# EAGLE design charlie_array_0805_v1 (EAGLE 6.4)
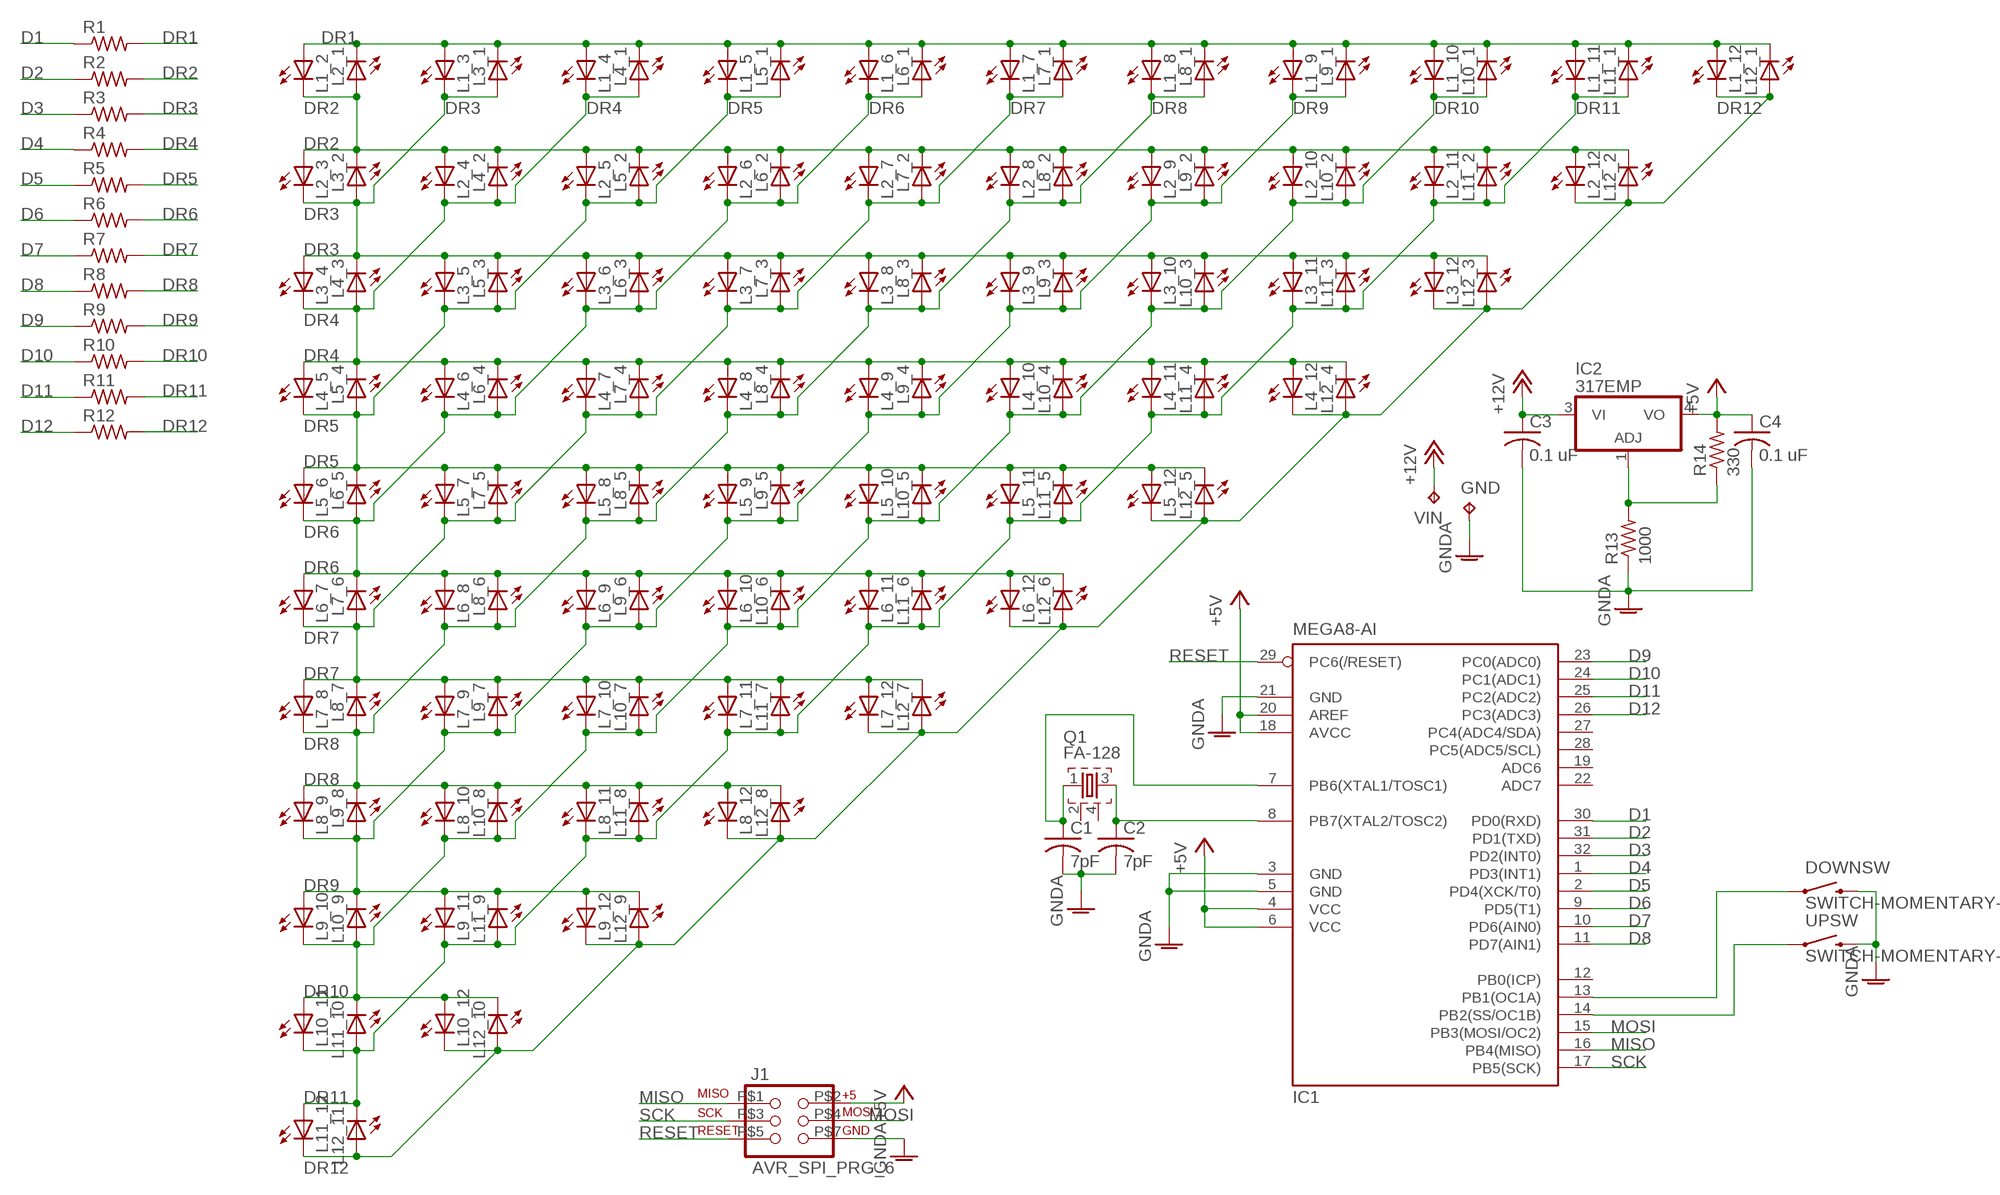
[diagram p0: schematic, sheet 1]

## Parts
C1  7pF  C-USC0603  [C0603]
C2  7pF  C-USC0603  [C0603]
C3  0.1 uF  C-USC0603  [C0603]
C4  0.1 uF  C-USC0603  [C0603]
DOWNSW  SWITCH-MOMENTARY-2  [TACTILE_SWITCH_TALL]
GND  TPTP20SQ  [TP20SQ]
IC1  MEGA8-AI  [TQFP32-08]
IC2  317EMP  [SOT223]
J1  AVR_SPI_PRG_6  [2X3_ICSP_SMD]
L1_2  LEDCHIPLED_0805  [CHIPLED_0805]
L1_3  LEDCHIPLED_0805  [CHIPLED_0805]
L1_4  LEDCHIPLED_0805  [CHIPLED_0805]
L1_5  LEDCHIPLED_0805  [CHIPLED_0805]
L1_6  LEDCHIPLED_0805  [CHIPLED_0805]
L1_7  LEDCHIPLED_0805  [CHIPLED_0805]
L1_8  LEDCHIPLED_0805  [CHIPLED_0805]
L1_9  LEDCHIPLED_0805  [CHIPLED_0805]
L1_10  LEDCHIPLED_0805  [CHIPLED_0805]
L1_11  LEDCHIPLED_0805  [CHIPLED_0805]
L1_12  LEDCHIPLED_0805  [CHIPLED_0805]
L2_1  LEDCHIPLED_0805  [CHIPLED_0805]
L2_3  LEDCHIPLED_0805  [CHIPLED_0805]
L2_4  LEDCHIPLED_0805  [CHIPLED_0805]
L2_5  LEDCHIPLED_0805  [CHIPLED_0805]
L2_6  LEDCHIPLED_0805  [CHIPLED_0805]
L2_7  LEDCHIPLED_0805  [CHIPLED_0805]
L2_8  LEDCHIPLED_0805  [CHIPLED_0805]
L2_9  LEDCHIPLED_0805  [CHIPLED_0805]
L2_10  LEDCHIPLED_0805  [CHIPLED_0805]
L2_11  LEDCHIPLED_0805  [CHIPLED_0805]
L2_12  LEDCHIPLED_0805  [CHIPLED_0805]
L3_1  LEDCHIPLED_0805  [CHIPLED_0805]
L3_2  LEDCHIPLED_0805  [CHIPLED_0805]
L3_4  LEDCHIPLED_0805  [CHIPLED_0805]
L3_5  LEDCHIPLED_0805  [CHIPLED_0805]
L3_6  LEDCHIPLED_0805  [CHIPLED_0805]
L3_7  LEDCHIPLED_0805  [CHIPLED_0805]
L3_8  LEDCHIPLED_0805  [CHIPLED_0805]
L3_9  LEDCHIPLED_0805  [CHIPLED_0805]
L3_10  LEDCHIPLED_0805  [CHIPLED_0805]
L3_11  LEDCHIPLED_0805  [CHIPLED_0805]
L3_12  LEDCHIPLED_0805  [CHIPLED_0805]
L4_1  LEDCHIPLED_0805  [CHIPLED_0805]
L4_2  LEDCHIPLED_0805  [CHIPLED_0805]
L4_3  LEDCHIPLED_0805  [CHIPLED_0805]
L4_5  LEDCHIPLED_0805  [CHIPLED_0805]
L4_6  LEDCHIPLED_0805  [CHIPLED_0805]
L4_7  LEDCHIPLED_0805  [CHIPLED_0805]
L4_8  LEDCHIPLED_0805  [CHIPLED_0805]
L4_9  LEDCHIPLED_0805  [CHIPLED_0805]
L4_10  LEDCHIPLED_0805  [CHIPLED_0805]
L4_11  LEDCHIPLED_0805  [CHIPLED_0805]
L4_12  LEDCHIPLED_0805  [CHIPLED_0805]
L5_1  LEDCHIPLED_0805  [CHIPLED_0805]
L5_2  LEDCHIPLED_0805  [CHIPLED_0805]
L5_3  LEDCHIPLED_0805  [CHIPLED_0805]
L5_4  LEDCHIPLED_0805  [CHIPLED_0805]
L5_6  LEDCHIPLED_0805  [CHIPLED_0805]
L5_7  LEDCHIPLED_0805  [CHIPLED_0805]
L5_8  LEDCHIPLED_0805  [CHIPLED_0805]
L5_9  LEDCHIPLED_0805  [CHIPLED_0805]
L5_10  LEDCHIPLED_0805  [CHIPLED_0805]
L5_11  LEDCHIPLED_0805  [CHIPLED_0805]
L5_12  LEDCHIPLED_0805  [CHIPLED_0805]
L6_1  LEDCHIPLED_0805  [CHIPLED_0805]
L6_2  LEDCHIPLED_0805  [CHIPLED_0805]
L6_3  LEDCHIPLED_0805  [CHIPLED_0805]
L6_4  LEDCHIPLED_0805  [CHIPLED_0805]
L6_5  LEDCHIPLED_0805  [CHIPLED_0805]
L6_7  LEDCHIPLED_0805  [CHIPLED_0805]
L6_8  LEDCHIPLED_0805  [CHIPLED_0805]
L6_9  LEDCHIPLED_0805  [CHIPLED_0805]
L6_10  LEDCHIPLED_0805  [CHIPLED_0805]
L6_11  LEDCHIPLED_0805  [CHIPLED_0805]
L6_12  LEDCHIPLED_0805  [CHIPLED_0805]
L7_1  LEDCHIPLED_0805  [CHIPLED_0805]
L7_2  LEDCHIPLED_0805  [CHIPLED_0805]
L7_3  LEDCHIPLED_0805  [CHIPLED_0805]
L7_4  LEDCHIPLED_0805  [CHIPLED_0805]
L7_5  LEDCHIPLED_0805  [CHIPLED_0805]
L7_6  LEDCHIPLED_0805  [CHIPLED_0805]
L7_8  LEDCHIPLED_0805  [CHIPLED_0805]
L7_9  LEDCHIPLED_0805  [CHIPLED_0805]
L7_10  LEDCHIPLED_0805  [CHIPLED_0805]
L7_11  LEDCHIPLED_0805  [CHIPLED_0805]
L7_12  LEDCHIPLED_0805  [CHIPLED_0805]
L8_1  LEDCHIPLED_0805  [CHIPLED_0805]
L8_2  LEDCHIPLED_0805  [CHIPLED_0805]
L8_3  LEDCHIPLED_0805  [CHIPLED_0805]
L8_4  LEDCHIPLED_0805  [CHIPLED_0805]
L8_5  LEDCHIPLED_0805  [CHIPLED_0805]
L8_6  LEDCHIPLED_0805  [CHIPLED_0805]
L8_7  LEDCHIPLED_0805  [CHIPLED_0805]
L8_9  LEDCHIPLED_0805  [CHIPLED_0805]
L8_10  LEDCHIPLED_0805  [CHIPLED_0805]
L8_11  LEDCHIPLED_0805  [CHIPLED_0805]
L8_12  LEDCHIPLED_0805  [CHIPLED_0805]
L9_1  LEDCHIPLED_0805  [CHIPLED_0805]
L9_2  LEDCHIPLED_0805  [CHIPLED_0805]
L9_3  LEDCHIPLED_0805  [CHIPLED_0805]
L9_4  LEDCHIPLED_0805  [CHIPLED_0805]
L9_5  LEDCHIPLED_0805  [CHIPLED_0805]
L9_6  LEDCHIPLED_0805  [CHIPLED_0805]
L9_7  LEDCHIPLED_0805  [CHIPLED_0805]
L9_8  LEDCHIPLED_0805  [CHIPLED_0805]
L9_10  LEDCHIPLED_0805  [CHIPLED_0805]
L9_11  LEDCHIPLED_0805  [CHIPLED_0805]
L9_12  LEDCHIPLED_0805  [CHIPLED_0805]
L10_1  LEDCHIPLED_0805  [CHIPLED_0805]
L10_2  LEDCHIPLED_0805  [CHIPLED_0805]
L10_3  LEDCHIPLED_0805  [CHIPLED_0805]
L10_4  LEDCHIPLED_0805  [CHIPLED_0805]
L10_5  LEDCHIPLED_0805  [CHIPLED_0805]
L10_6  LEDCHIPLED_0805  [CHIPLED_0805]
L10_7  LEDCHIPLED_0805  [CHIPLED_0805]
L10_8  LEDCHIPLED_0805  [CHIPLED_0805]
L10_9  LEDCHIPLED_0805  [CHIPLED_0805]
L10_11  LEDCHIPLED_0805  [CHIPLED_0805]
L10_12  LEDCHIPLED_0805  [CHIPLED_0805]
L11_1  LEDCHIPLED_0805  [CHIPLED_0805]
L11_2  LEDCHIPLED_0805  [CHIPLED_0805]
L11_3  LEDCHIPLED_0805  [CHIPLED_0805]
L11_4  LEDCHIPLED_0805  [CHIPLED_0805]
L11_5  LEDCHIPLED_0805  [CHIPLED_0805]
L11_6  LEDCHIPLED_0805  [CHIPLED_0805]
L11_7  LEDCHIPLED_0805  [CHIPLED_0805]
L11_8  LEDCHIPLED_0805  [CHIPLED_0805]
L11_9  LEDCHIPLED_0805  [CHIPLED_0805]
L11_10  LEDCHIPLED_0805  [CHIPLED_0805]
L11_12  LEDCHIPLED_0805  [CHIPLED_0805]
L12_1  LEDCHIPLED_0805  [CHIPLED_0805]
L12_2  LEDCHIPLED_0805  [CHIPLED_0805]
L12_3  LEDCHIPLED_0805  [CHIPLED_0805]
L12_4  LEDCHIPLED_0805  [CHIPLED_0805]
L12_5  LEDCHIPLED_0805  [CHIPLED_0805]
L12_6  LEDCHIPLED_0805  [CHIPLED_0805]
L12_7  LEDCHIPLED_0805  [CHIPLED_0805]
L12_8  LEDCHIPLED_0805  [CHIPLED_0805]
L12_9  LEDCHIPLED_0805  [CHIPLED_0805]
L12_10  LEDCHIPLED_0805  [CHIPLED_0805]
L12_11  LEDCHIPLED_0805  [CHIPLED_0805]
Q1  FA-128  [FA-128]
R1  R-US_R0603  [R0603]
R2  R-US_R0603  [R0603]
R3  R-US_R0603  [R0603]
R4  R-US_R0603  [R0603]
R5  R-US_R0603  [R0603]
R6  R-US_R0603  [R0603]
R7  R-US_R0603  [R0603]
R8  R-US_R0603  [R0603]
R9  R-US_R0603  [R0603]
R10  R-US_R0603  [R0603]
R11  R-US_R0603  [R0603]
R12  R-US_R0603  [R0603]
R13  1000  R-US_R0603  [R0603]
R14  330  R-US_R0603  [R0603]
UPSW  SWITCH-MOMENTARY-2  [TACTILE_SWITCH_TALL]
VIN  TPTP20SQ  [TP20SQ]

## Nets
+5V: C4.1 IC1.4(VCC) IC1.6(VCC) IC1.18(AVCC) IC1.20(AREF) IC2.4(VO) J1.P$2 R14.2
+12V: C3.1 IC2.3(VI) VIN.TP
D1: IC1.30(PD0(RXD)) R1.1
D2: IC1.31(PD1(TXD)) R2.1
D3: IC1.32(PD2(INT0)) R3.1
D4: IC1.1(PD3(INT1)) R4.1
D5: IC1.2(PD4(XCK/T0)) R5.1
D6: IC1.9(PD5(T1)) R6.1
D7: IC1.10(PD6(AIN0)) R7.1
D8: IC1.11(PD7(AIN1)) R8.1
D9: IC1.23(PC0(ADC0)) R9.1
D10: IC1.24(PC1(ADC1)) R10.1
D11: IC1.25(PC2(ADC2)) R11.1
D12: IC1.26(PC3(ADC3)) R12.1
DR1: L1_2.A L1_3.A L1_4.A L1_5.A L1_6.A L1_7.A L1_8.A L1_9.A L1_10.A L1_11.A L1_12.A L2_1.C L3_1.C L4_1.C L5_1.C L6_1.C L7_1.C L8_1.C L9_1.C L10_1.C L11_1.C L12_1.C R1.2
DR2: L1_2.C L2_1.A L2_3.A L2_4.A L2_5.A L2_6.A L2_7.A L2_8.A L2_9.A L2_10.A L2_11.A L2_12.A L3_2.C L4_2.C L5_2.C L6_2.C L7_2.C L8_2.C L9_2.C L10_2.C L11_2.C L12_2.C R2.2
DR3: L1_3.C L2_3.C L3_1.A L3_2.A L3_4.A L3_5.A L3_6.A L3_7.A L3_8.A L3_9.A L3_10.A L3_11.A L3_12.A L4_3.C L5_3.C L6_3.C L7_3.C L8_3.C L9_3.C L10_3.C L11_3.C L12_3.C R3.2
DR4: L1_4.C L2_4.C L3_4.C L4_1.A L4_2.A L4_3.A L4_5.A L4_6.A L4_7.A L4_8.A L4_9.A L4_10.A L4_11.A L4_12.A L5_4.C L6_4.C L7_4.C L8_4.C L9_4.C L10_4.C L11_4.C L12_4.C R4.2
DR5: L1_5.C L2_5.C L3_5.C L4_5.C L5_1.A L5_2.A L5_3.A L5_4.A L5_6.A L5_7.A L5_8.A L5_9.A L5_10.A L5_11.A L5_12.A L6_5.C L7_5.C L8_5.C L9_5.C L10_5.C L11_5.C L12_5.C R5.2
DR6: L1_6.C L2_6.C L3_6.C L4_6.C L5_6.C L6_1.A L6_2.A L6_3.A L6_4.A L6_5.A L6_7.A L6_8.A L6_9.A L6_10.A L6_11.A L6_12.A L7_6.C L8_6.C L9_6.C L10_6.C L11_6.C L12_6.C R6.2
DR7: L1_7.C L2_7.C L3_7.C L4_7.C L5_7.C L6_7.C L7_1.A L7_2.A L7_3.A L7_4.A L7_5.A L7_6.A L7_8.A L7_9.A L7_10.A L7_11.A L7_12.A L8_7.C L9_7.C L10_7.C L11_7.C L12_7.C R7.2
DR8: L1_8.C L2_8.C L3_8.C L4_8.C L5_8.C L6_8.C L7_8.C L8_1.A L8_2.A L8_3.A L8_4.A L8_5.A L8_6.A L8_7.A L8_9.A L8_10.A L8_11.A L8_12.A L9_8.C L10_8.C L11_8.C L12_8.C R8.2
DR9: L1_9.C L2_9.C L3_9.C L4_9.C L5_9.C L6_9.C L7_9.C L8_9.C L9_1.A L9_2.A L9_3.A L9_4.A L9_5.A L9_6.A L9_7.A L9_8.A L9_10.A L9_11.A L9_12.A L10_9.C L11_9.C L12_9.C R9.2
DR10: L1_10.C L2_10.C L3_10.C L4_10.C L5_10.C L6_10.C L7_10.C L8_10.C L9_10.C L10_1.A L10_2.A L10_3.A L10_4.A L10_5.A L10_6.A L10_7.A L10_8.A L10_9.A L10_11.A L10_12.A L11_10.C L12_10.C R10.2
DR11: L1_11.C L2_11.C L3_11.C L4_11.C L5_11.C L6_11.C L7_11.C L8_11.C L9_11.C L10_11.C L11_1.A L11_2.A L11_3.A L11_4.A L11_5.A L11_6.A L11_7.A L11_8.A L11_9.A L11_10.A L11_12.A L12_11.C R11.2
DR12: L1_12.C L2_12.C L3_12.C L4_12.C L5_12.C L6_12.C L7_12.C L8_12.C L9_12.C L10_12.C L11_12.C L12_1.A L12_2.A L12_3.A L12_4.A L12_5.A L12_6.A L12_7.A L12_8.A L12_9.A L12_10.A L12_11.A R12.2
GNDA: C1.2 C2.2 C3.2 C4.2 DOWNSW.B2 GND.TP IC1.3(GND) IC1.5(GND) IC1.21(GND) J1.P$7 R13.1 UPSW.B2
MISO: IC1.16(PB4(MISO)) J1.P$1
MOSI: IC1.15(PB3(MOSI/OC2)) J1.P$4
N$1: C2.1 IC1.8(PB7(XTAL2/TOSC2)) Q1.3
N$2: IC1.14(PB2(SS/OC1B)) UPSW.A2
N$3: DOWNSW.A2 IC1.13(PB1(OC1A))
N$4: C1.1 IC1.7(PB6(XTAL1/TOSC1)) Q1.1
N$5: IC2.1(ADJ) R13.2 R14.1
RESET: IC1.29(PC6(/RESET)) J1.P$5
SCK: IC1.17(PB5(SCK)) J1.P$3
Unconnected: IC1.12(PB0(ICP)) IC1.19(ADC6) IC1.22(ADC7) IC1.27(PC4(ADC4/SDA)) IC1.28(PC5(ADC5/SCL)) Q1.2 Q1.4

## Library data of the parts
C1-C4 = rcl:C-US: CAPACITOR, American symbol
DOWNSW UPSW = SparkFun:SWITCH-MOMENTARY-2
GND VIN = testpad:TP: Test pad
IC1 = atmel:MEGA8: MICROCONTROLLER 8 Kbytes FLASH, 1 kbytes SRAM, 512 bytes EEPROM, USART, 6-channel 10 bit ADC, 2-channel 8 bit ADC Pin compatible with Atmega48, ATMega88, ATMega168 Source: avr.lbr; MPN: ATMEGA8-16AU; OC_FARNELL: 9171371; OC_NEWARK: 73M8863
IC2 = linear:*317: Positive VOLTAGE REGULATOR
J1 = SparkFun:AVR_SPI_PRG_6: AVR ISP 6 Pin This is the reduced ISP connector for AVR programming. Common on Arduino. This footprint will take up less PCB space and can be used with a 10-pin to 6-pin adapter such as SKU: BOB-08508
L1_2-L1_12 L2_1 L2_3-L2_12 L3_1 L3_2 L3_4-L3_12 L4_1-L4_3 L4_5-L4_12 L5_1-L5_4 L5_6-L5_12 L6_1-L6_5 L6_7-L6_12 L7_1-L7_6 L7_8-L7_12 L8_1-L8_7 L8_9-L8_12 L9_1-L9_8 L9_10-L9_12 L10_1-L10_9 L10_11 L10_12 L11_1-L11_10 L11_12 L12_1-L12_11 = led:LED: LED OSRAM: - CHIPLED LG R971, LG N971, LY N971, LG Q971, LY Q971, LO R971, LY R971 LH N974, LH R974 LS Q976, LO Q976, LY Q976 LO Q996 - Hyper CHIPLED LW Q18S LB Q993, LB Q99A, LB R99A - SideLED LS A670, LO A670, LY A670, LG A670, LP A670 LB A673, LV A673, LT A673, LW A673 LH A674 LY A675 LS A676, LA A676, LO A676, LY A676, LW A676 LS A679, LY A679, LG A679 - Hyper Micro SIDELED® LS Y876, LA Y876, LO Y876, LY Y876 LT Y87S - SmartLED LW L88C, LW L88S LB L89C, LB L89S, LG L890 LS L89K, LO L89K, LY L89K LS L896, LA L896, LO L896, LY L896 - TOPLED LS T670, LO T670, LY T670, LG T670, LP T670 LSG T670, LSP T670, LSY T670, LOP T670, LYG T670 LG T671, LOG T671, LSG T671 LB T673, LV T673, LT T673, LW T673 LH T674 LS T676, LA T676, LO T676, LY T676, LB T676, LH T676, LSB T676, LW T676 LB T67C, LV T67C, LT T67C, LS T67K, LO T67K, LY T67K, LW E67C LS E67B, LA E67B, LO E67B, LY E67B, LB E67C, LV E67C, LT E67C LW T67C LS T679, LY T679, LG T679 LS T770, LO T770, LY T770, LG T770, LP T770 LB T773, LV T773, LT T773, LW T773 LH T774 LS E675, LA E675, LY E675, LS T675 LS T776, LA T776, LO T776, LY T776, LB T776 LHGB T686 LT T68C, LB T68C - Hyper Mini TOPLED® LB M676 - Mini TOPLED Santana® LG M470 LS M47K, LO M47K, LY M47K Source: http://www.osram.convergy.de LUXEON: - LUMILED® LXK2-PW12-R00, LXK2-PW12-S00, LXK2-PW14-U00, LXK2-PW14-V00 LXK2-PM12-R00, LXK2-PM12-S00, LXK2-PM14-U00 LXK2-PE12-Q00, LXK2-PE12-R00, LXK2-PE12-S00, LXK2-PE14-T00, LXK2-PE14-U00 LXK2-PB12-K00, LXK2-PB12-L00, LXK2-PB12-M00, LXK2-PB14-N00, LXK2-PB14-P00, LXK2-PB14-Q00 LXK2-PR12-L00, LXK2-PR12-M00, LXK2-PR14-Q00, LXK2-PR14-R00 LXK2-PD12-Q00, LXK2-PD12-R00, LXK2-PD12-S00 LXK2-PH12-R00, LXK2-PH12-S00 LXK2-PL12-P00, LXK2-PL12-Q00, LXK2-PL12-R00 Source: www.luxeon.com KINGBRIGHT: KA-3528ASYC Source: www.kingbright.com
Q1 = crystal:FA-: MHz RANGE CRYSTAL UNIT Source: Epson Toyocom
R1-R14 = rcl:R-US_: RESISTOR, American symbol

## Board
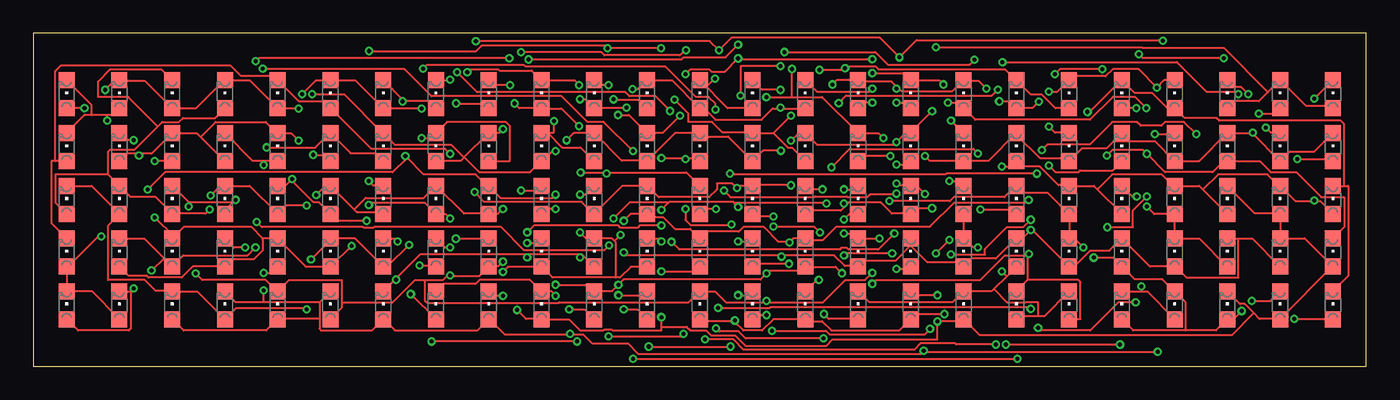
[diagram p1: board, top side]
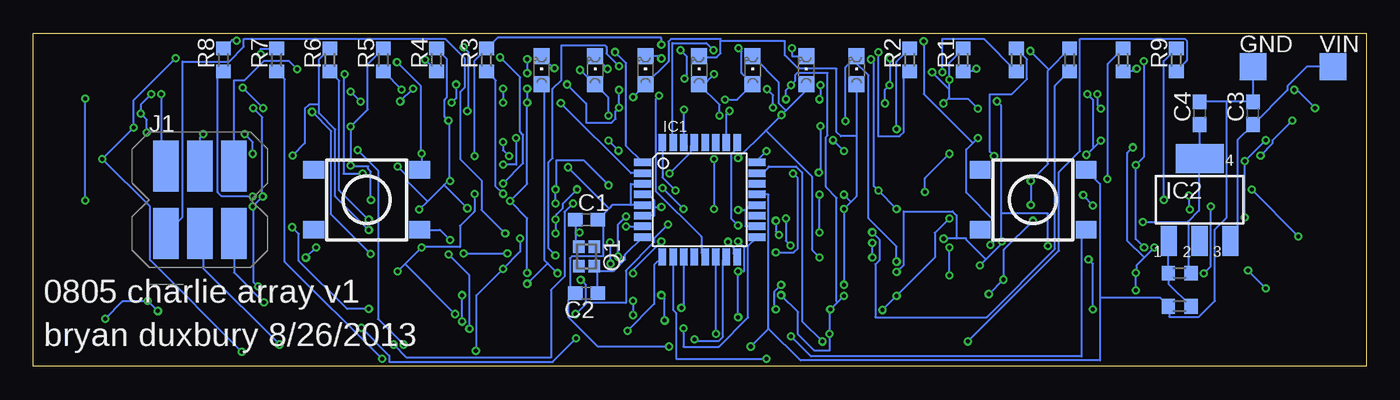
[diagram p2: board, bottom side, seen from below]

Size 100 x 25 mm. Coordinates in mm from the lower left corner, seen from the top.
Outline: 0,0 100,0 100,25 0,25 0,0
Copper layers (1*16): Top 0.035mm / dielectric 0.2mm / Bottom 0.035mm
Design rules "SeeedStudio_DRU_no_angle_20130527 *": minimum track width 6mil, minimum drill 12mil, track to track 6mil, track to pad 6mil, pad to pad 6mil, via to via 6mil, smd to smd 0mil, copper to edge 10mil, drill to drill 10mil, minimum pad ring 6mil, minimum via ring 6mil, stop-mask expansion 2mil, vias tented up to drill 25mil, thermal gap 10mil

### Footprints (pad centres in the part's own frame; a part is rotated, then mirrored left to right if it is on the bottom)
C0603 = smd 1.1 x 1: 1 -0.85,0; 2 0.85,0
TACTILE_SWITCH_TALL = smd 1.55 x 1.3: A1 -3.975,-2.25; A2 3.975,-2.25; B1 -3.975,2.25; B2 3.975,2.25
TP20SQ = smd 2 x 2: TP 0,0
TQFP32-08 = smd 1.27 x 0.559: 1 -4.293,2.8; 2 -4.293,2; 3 -4.293,1.2; 4 -4.293,0.4; 5 -4.293,-0.4; 6 -4.293,-1.2; 7 -4.293,-2; 8 -4.293,-2.8; 17 4.293,-2.8; 18 4.293,-2; 19 4.293,-1.2; 20 4.293,-0.4; 21 4.293,0.4; 22 4.293,1.2; 23 4.293,2; 24 4.293,2.8 | smd 0.559 x 1.27: 9 -2.8,-4.293; 10 -2,-4.293; 11 -1.2,-4.293; 12 -0.4,-4.293; 13 0.4,-4.293; 14 1.2,-4.293; 15 2,-4.293; 16 2.8,-4.293; 25 2.8,4.293; 26 2,4.293; 27 1.2,4.293; 28 0.4,4.293; 29 -0.4,4.293; 30 -1.2,4.293; 31 -2,4.293; 32 -2.8,4.293
SOT223 = smd 1.219 x 2.235: 1 -2.311,-3.099; 2 0,-3.099; 3 2.311,-3.099 | smd 3.6 x 2.2: 4 0,3.099
2X3_ICSP_SMD = smd 1.905 x 3.81: P$1 -2.54,-2.54; P$2 0,-2.54; P$3 2.54,-2.54; P$4 0,2.54; P$5 2.54,2.54; P$7 -2.54,2.54
CHIPLED_0805 = smd 1.2 x 1.2: A 0,-1.05; C 0,1.05
FA-128 = smd 0.95 x 0.85: 1 -0.725,-0.575; 2 0.725,-0.575; 3 0.725,0.575; 4 -0.725,0.575
R0603 = smd 1 x 1.1: 1 -0.85,0; 2 0.85,0

### Placement (x,y rotation side)
C1  58.5,11 0 bottom
C2  58.5,5.5 180 bottom
C3  8.5,19 90 bottom
C4  12.5,19 90 bottom
DOWNSW  75,12.5 0 bottom
GND  8.5,22.5 0 bottom
IC1  50,12.5 0 bottom
IC2  12.5,12.5 0 bottom
J1  87.5,12.5 0 bottom
L1_2  2.5,20.42 0 top
L1_3  10.42,20.42 0 top
L1_4  18.33,20.42 0 top
L1_5  26.25,20.42 0 top
L1_6  34.17,20.42 0 top
L1_7  42.08,20.42 0 top
L1_8  50,20.42 0 top
L1_9  57.92,20.42 0 top
L1_10  65.83,20.42 0 top
L1_11  73.75,20.42 0 top
L1_12  81.67,20.42 0 top
L2_1  6.46,20.42 0 top
L2_3  89.58,20.42 0 top
L2_4  97.5,20.42 0 top
L2_5  6.46,16.46 0 top
L2_6  14.38,16.46 0 top
L2_7  22.29,16.46 0 top
L2_8  30.21,16.46 0 top
L2_9  38.12,16.46 0 top
L2_10  46.04,16.46 0 top
L2_11  53.96,16.46 0 top
L2_12  61.88,16.46 0 top
L3_1  14.38,20.42 0 top
L3_2  93.54,20.42 0 top
L3_4  69.79,16.46 0 top
L3_5  77.71,16.46 0 top
L3_6  85.62,16.46 0 top
L3_7  93.54,16.46 0 top
L3_8  2.5,12.5 0 top
L3_9  10.42,12.5 0 top
L3_10  18.33,12.5 0 top
L3_11  26.25,12.5 0 top
L3_12  34.17,12.5 0 top
L4_1  22.29,20.42 0 top
L4_2  2.5,16.46 0 top
L4_3  73.75,16.46 0 top
L4_5  42.08,12.5 0 top
L4_6  50,12.5 0 top
L4_7  57.92,12.5 0 top
L4_8  65.83,12.5 0 top
L4_9  73.75,12.5 0 top
L4_10  81.67,12.5 0 top
L4_11  89.58,12.5 0 top
L4_12  97.5,12.5 0 top
L5_1  30.21,20.42 0 top
L5_2  10.42,16.46 0 top
L5_3  81.67,16.46 0 top
L5_4  46.04,12.5 0 top
L5_6  6.46,8.54 0 top
L5_7  14.38,8.54 0 top
L5_8  22.29,8.54 0 top
L5_9  30.21,8.54 0 top
L5_10  38.12,8.54 0 top
L5_11  46.04,8.54 0 top
L5_12  53.96,8.54 0 top
L6_1  38.12,20.42 0 top
L6_2  18.33,16.46 0 top
L6_3  89.58,16.46 0 top
L6_4  53.96,12.5 0 top
L6_5  10.42,8.54 0 top
L6_7  61.88,8.54 0 top
L6_8  69.79,8.54 0 top
L6_9  77.71,8.54 0 top
L6_10  85.62,8.54 0 top
L6_11  93.54,8.54 0 top
L6_12  2.5,4.58 0 top
L7_1  46.04,20.42 0 top
L7_2  26.25,16.46 0 top
L7_3  97.5,16.46 0 top
L7_4  61.88,12.5 0 top
L7_5  18.33,8.54 0 top
L7_6  65.83,8.54 0 top
L7_8  10.42,4.58 0 top
L7_9  18.33,4.58 0 top
L7_10  26.25,4.58 0 top
L7_11  34.17,4.58 0 top
L7_12  42.08,4.58 0 top
L8_1  53.96,20.42 0 top
L8_2  34.17,16.46 0 top
L8_3  6.46,12.5 0 top
L8_4  69.79,12.5 0 top
L8_5  26.25,8.54 0 top
L8_6  73.75,8.54 0 top
L8_7  14.38,4.58 0 top
L8_9  50,4.58 0 top
L8_10  57.92,4.58 0 top
L8_11  65.83,4.58 0 top
L8_12  73.75,4.58 0 top
L9_1  61.88,20.42 0 top
L9_2  42.08,16.46 0 top
L9_3  14.38,12.5 0 top
L9_4  77.71,12.5 0 top
L9_5  34.17,8.54 0 top
L9_6  81.67,8.54 0 top
L9_7  22.29,4.58 0 top
L9_8  53.96,4.58 0 top
L9_10  81.67,4.58 0 top
L9_11  89.58,4.58 0 top
L9_12  97.5,4.58 0 top
L10_1  69.79,20.42 0 top
L10_2  50,16.46 0 top
L10_3  22.29,12.5 0 top
L10_4  85.62,12.5 0 top
L10_5  42.08,8.54 0 top
L10_6  89.58,8.54 0 top
L10_7  30.21,4.58 0 top
L10_8  61.88,4.58 0 top
L10_9  85.62,4.58 0 top
L10_11  42.01,22.23 0 bottom
L10_12  50.05,22.23 0 bottom
L11_1  77.71,20.42 0 top
L11_2  57.92,16.46 0 top
L11_3  30.21,12.5 0 top
L11_4  93.54,12.5 0 top
L11_5  50,8.54 0 top
L11_6  97.5,8.54 0 top
L11_7  38.12,4.58 0 top
L11_8  69.79,4.58 0 top
L11_9  93.54,4.58 0 top
L11_10  46.03,22.23 0 bottom
L11_12  57.84,22.23 0 bottom
L12_1  85.62,20.42 0 top
L12_2  65.83,16.46 0 top
L12_3  38.12,12.5 0 top
L12_4  2.5,8.54 0 top
L12_5  57.92,8.54 0 top
L12_6  6.46,4.58 0 top
L12_7  46.04,4.58 0 top
L12_8  77.71,4.58 0 top
L12_9  38.23,22.23 0 bottom
L12_10  54.07,22.23 0 bottom
L12_11  61.87,22.23 0 bottom
Q1  58.5,8.25 270 bottom
R1  30.25,23 90 bottom
R2  34.25,23 90 bottom
R3  66,23 90 bottom
R4  69.75,23 90 bottom
R5  73.75,23 90 bottom
R6  77.76,23 90 bottom
R7  81.75,23 90 bottom
R8  85.75,23 90 bottom
R9  14.25,23 90 bottom
R10  18.25,23 90 bottom
R11  22.25,23 90 bottom
R12  26.25,23 90 bottom
R13  14,4.5 0 bottom
R14  14,7 0 bottom
UPSW  25,12.5 0 bottom
VIN  2.5,22.5 0 bottom

### Tracks (layer width: path | path; a pad name or v marks a point on that pad's centre or on a via)
+5V  (via drill 0.3)
  Top 0.152: 47.62,12.24 47.73,12.34 52.5,12.34 52.6,12.24 | 47.62,12.24 v47.12,11.73 | v52.88,11.96 52.6,12.24 | v72.97,1.63 v81.53,1.63 | v59.51,12.22 59.44,12.29 52.65,12.29 52.6,12.24 | v16.76,10.82 17.14,10.44 24.74,10.44 24.79,10.39 25.5,10.39 25.55,10.44 35.1,10.44 36.83,8.71 42.82,8.71 v43.18,9.07 | v43.54,11.1 44.73,12.29 47.57,12.29 47.62,12.24
  Bottom 0.152: C4.1 12.5,18.14 12.5,15.62 IC2.4 12.55,15.54 12.55,11.68 13.36,10.87 13.36,10.82 | 13.36,10.82 13.36,7.21 R14.2 | 46.58,11.68 46.58,10.52 45.72,10.52 IC1.18 | 46.58,11.68 46.18,12.09 IC1.20 | 53.42,11.96 53.42,12.47 53.82,12.88 54.28,12.88 IC1.4 | 53.42,11.96 53.42,11.3 IC1.6 | v47.12,11.73 46.63,11.73 46.58,11.68 | 53.42,11.96 v52.88,11.96 | v81.53,1.63 87.22,7.32 87.22,9.7 87.48,9.96 J1.P$2 | v72.97,1.63 71.98,0.64 61.16,0.64 61.16,5.71 60.15,6.73 60.15,11.58 v59.51,12.22 | v16.76,10.82 13.36,10.82 | v43.18,9.07 43.54,9.42 v43.54,11.1
+12V
  Bottom 0.152: VIN.TP 2.52,22.48 4.47,22.48 5.92,21.03 5.92,20.73 8.48,18.16 C3.1 8.53,18.09 9.65,16.97 9.65,9.96 10.19,9.42 IC2.3
D1  (via drill 0.3)
  Top 0.152: v29.23,22.35 29.49,22.61 36.83,22.61 36.93,22.5 47.42,22.5 49.71,20.22 50.67,20.22 51.18,19.71 v51.18,19.28
  Bottom 0.152: v29.23,22.35 29.23,22.17 30.23,22.17 R1.1 | v51.18,19.28 51.18,16.82 IC1.30
D2  (via drill 0.3)
  Top 0.152: v36.6,23.57 42.62,23.57 42.85,23.34 48.51,23.34 48.9,23.72 v48.97,23.72
  Bottom 0.152: v36.6,23.57 36.63,23.55 36.63,17.27 35,17.27 34.7,17.58 34.7,21.72 34.27,22.15 R2.1 | v48.97,23.72 49.51,24.26 52.05,24.26 52.05,16.84 52.02,16.82 IC1.31
D3  (via drill 0.3)
  Top 0.152: v64.77,12.95 64.75,12.93 62.79,12.93 62.56,12.7 61.09,12.7 61.04,12.75 58.65,12.75 58.6,12.7 52.3,12.7 v51.82,13.18
  Bottom 0.152: v64.77,12.95 65.3,13.49 65.3,21.46 R3.1 | v51.82,13.18 52.81,14.17 IC1.32
D4  (via drill 0.3)
  Top 0.152: v70.61,23.01 70.26,22.66 64.11,22.66 63.17,23.6 v56.36,23.6
  Bottom 0.152: v70.61,23.01 69.77,22.17 R4.1 | v56.36,23.6 55.52,22.76 55.52,16.54 54.3,15.32 IC1.1
D5  (via drill 0.3)
  Top 0.152: v72.36,20.78 71.91,20.32 60.98,20.32 v60.43,19.76
  Bottom 0.152: v72.36,20.78 73.74,22.15 R5.1 | v60.43,19.76 55.17,14.5 54.3,14.5 IC1.2
D6  (via drill 0.3)
  Top 0.152: v74.83,11 74.27,10.44 73.05,10.44 71.4,8.79 71.4,8.38 v68.83,8.38 | v67.28,2.79 66.88,2.39 59.74,2.39 59.46,2.67 v55.42,2.67
  Bottom 0.152: v74.83,11 77.04,13.21 77.04,21.44 77.75,22.15 R6.1 | v68.83,8.38 67.28,6.83 v67.28,2.79 | v55.42,2.67 53.42,4.67 53.42,7.59 IC1.9
D7  (via drill 0.3)
  Top 0.152: v44.98,0.56 v73.84,0.56
  Bottom 0.152: v73.84,0.56 81.13,7.85 81.13,21.54 81.74,22.15 R7.1 | v44.98,0.56 51.77,0.56 51.77,3.99 51.99,4.22 IC1.10
D8  (via drill 0.3)
  Top 0.152: v83.54,12.75 82.5,11.71 82.5,10.44 v80.59,10.44 | v74.83,4.29 74.68,4.45 55.32,4.45 55.24,4.37 v51.38,4.37
  Bottom 0.152: v83.54,12.75 85.85,12.75 86.16,13.06 86.16,21.74 R8.1 | v80.59,10.44 80.09,9.93 80.09,7.92 76.45,4.29 v74.83,4.29 | v51.38,4.37 51.21,4.55 IC1.11
D9  (via drill 0.3)
  Top 0.152: v40.79,1.85 v29.87,1.85
  Bottom 0.152: v29.87,1.85 23.04,8.69 23.04,14.58 21.46,16.15 21.46,24.59 13.59,24.59 13.46,24.46 13.46,22.96 14.25,22.17 R9.1 | v40.79,1.85 42.32,3.38 42.32,14.55 42.77,15.01 44.83,15.01 44.83,14.94 45.26,14.5 45.7,14.5 IC1.23
D10  (via drill 0.3)
  Top 0.152: v17.22,22.35 17.27,22.3 27.84,22.3 29.87,20.27 39.65,20.27 41.58,18.34 42.8,18.34 v44.98,16.15
  Bottom 0.152: v17.22,22.35 17.22,22.17 18.24,22.17 R10.1 | v44.98,16.15 45.7,15.44 45.7,15.32 IC1.24
D11  (via drill 0.3)
  Top 0.152: v37.06,10.06 37.57,10.57 43.89,10.57 44.07,10.39 45.31,10.39 45.49,10.57 v47.12,10.57
  Bottom 0.152: v37.06,10.06 36.52,9.53 36.52,7.95 36.83,7.64 36.83,3.68 28.47,3.68 23.34,8.81 23.34,21.06 R11.1 | v47.12,10.57 47.65,11.1 47.65,15.9 47.22,16.33 47.22,16.79 IC1.25
D12  (via drill 0.3)
  Top 0.152: v31.8,22.07 33.3,20.57 44.42,20.57 44.73,20.27 46.69,20.27 v47.78,19.18
  Bottom 0.152: v31.8,22.07 31.8,24.59 28.68,24.59 26.26,22.17 R12.1 | v47.78,19.18 47.98,18.97 47.98,16.82 IC1.26
DR1  (via drill 0.3)
  Top 0.152: 56.06,19.36 55.47,19.36 54.63,18.52 51.18,18.52 50.37,19.33 50.06,19.33 L1_8.A 49.99,19.38 47.9,21.46 L7_1.C 45.97,21.44 45.34,20.8 v44.96,20.8 | 56.06,19.36 57.91,19.36 L1_9.A | v56.06,20.75 54.69,20.75 53.98,21.46 L8_1.C | v56.06,19.41 56.06,19.36 | v82.75,19.38 81.69,19.38 L1_12.A | L12_1.C 84.84,21.46 v84.3,20.93 82.93,22.3 80.97,22.3 80.44,21.77 78,21.77 77.72,21.49 L11_1.C 77.65,21.44 76.83,20.62 v76.2,20.62 | 64.85,20.93 65.15,20.62 68.94,20.62 69.77,21.46 L10_1.C 69.85,21.44 70.92,21.44 v71.5,20.85 | 64.85,20.93 64.39,21.39 61.98,21.39 61.9,21.46 L9_1.C 61.8,21.46 60.25,21.46 v59.94,21.16 | v64.77,19.79 65.41,19.79 65.81,19.38 L1_10.A | v64.77,20.85 64.85,20.93 | v72.47,19.89 73.23,19.89 73.74,19.38 L1_11.A 73.81,19.41 74.98,19.41 v75.44,19.86 | v3.83,19.38 2.52,19.38 L1_2.A | v5.38,20.75 6.1,21.46 L2_1.C 6.53,21.44 8.36,21.44 L1_3.A 10.49,19.38 12.22,19.38 14.3,21.46 L3_1.C 16.23,21.46 18.31,19.38 L1_4.A 18.39,19.36 v19.91,19.36 | v31.27,21.51 31.24,21.49 30.23,21.49 L5_1.C | v31.73,19.74 33.81,19.74 L1_6.A | v32.56,22.07 32.79,22.3 34.87,22.3 34.98,22.2 37.39,22.2 38.1,21.49 L6_1.C 38.2,21.46 40.59,21.46 v40.95,21.11 | v41.02,20.04 41.4,20.04 42.06,19.38 L1_7.A 42.14,19.41 v44.5,19.41 | v29.13,19.36 26.31,19.36 L1_5.A 26.24,19.38 24.16,21.46 L4_1.C 22.23,21.44 21.18,21.44 v20.17,20.42
  Bottom 0.152: v56.06,20.75 v56.06,19.41 56.31,19.15 56.31,18.59 56.62,18.29 58.52,18.29 58.52,19.74 v59.94,21.16 | v84.3,20.93 v82.75,19.38 | v64.77,20.85 v64.77,19.79 | v71.5,20.85 v72.47,19.89 | v75.44,19.86 v76.2,20.62 | v3.83,19.38 5.21,20.75 v5.38,20.75 | R1.2 30.25,23.82 31.27,22.81 v31.27,21.51 31.32,21.46 31.32,20.88 | 31.32,20.14 v31.73,19.74 | 31.32,20.88 31.32,20.14 | v32.56,22.07 31.37,20.88 31.32,20.88 | v41.02,20.04 40.95,20.12 v40.95,21.11 | v29.13,19.36 29.87,20.09 31.27,20.09 31.32,20.14 | v19.91,19.36 20.17,19.61 v20.17,20.42 | v44.96,20.8 44.5,20.34 v44.5,19.41
DR2  (via drill 0.3)
  Top 0.152: v35.23,17.8 34.95,17.53 34.19,17.53 L8_2.C 34.11,17.48 32.33,15.7 | 32.33,15.7 32.31,15.67 | 32.31,15.67 32.05,15.42 30.23,15.42 L2_8.A | 32.33,15.7 33.45,14.58 37.29,14.58 38.1,15.39 L2_9.A 38.2,15.42 38.94,16.15 v39.19,16.15 | 32.31,15.67 31.37,16.61 27.15,16.61 26.26,17.5 L7_2.C 26.19,17.55 23.32,20.42 v20.93,20.42 | 5.54,18.85 5.94,18.85 6.45,19.36 L2_1.A | 5.54,18.85 4.37,18.85 | 4.37,18.85 3.83,18.85 2.52,17.53 L4_2.C | 4.37,18.85 4.37,19.61 2.52,21.46 L1_2.C | v20.98,15.88 21.82,15.88 22.28,15.42 L2_7.A | v19.91,16.94 19.36,17.5 L6_2.C 18.26,17.53 17.45,18.34 13.66,18.34 12.55,17.22 | 7.92,15.95 8.87,15.95 L5_2.C 10.49,17.5 12.27,17.5 12.55,17.22 | 7.92,15.95 7.01,15.95 6.48,15.42 L2_5.A | 12.55,17.22 14.35,15.42 L2_6.A | v5.54,18.44 5.54,18.85 | 7.92,15.95 v7.92,15.82 | 92.63,20.57 93.52,21.46 L3_2.C 93.6,21.44 95.48,19.56 97.31,19.56 97.48,19.38 L2_4.A | 92.63,20.57 91.95,19.89 90.09,19.89 L2_3.A | v64.31,15.77 62.26,15.77 61.9,15.42 L2_12.A | 92.63,20.57 89.31,23.9 83.24,23.9 83.19,23.95 v67.72,23.95 | v67.44,19.15 65.86,17.58 L12_2.C 65.81,17.5 65.43,17.5 v64.77,16.84 64.54,16.61 58.83,16.61 57.94,17.5 L11_2.C 57.86,17.45 57.35,17.45 v56.84,16.94 | v56.08,16.18 54.76,16.18 54.03,15.44 L2_11.A 52.12,17.25 50.29,17.25 50.06,17.48 L10_2.C 49.99,17.5 48.13,17.5 L2_10.A 45.97,15.44 44.15,15.44 L9_2.C 42.01,17.5 40.54,17.5 v40.01,16.97
  Bottom 0.152: v35.23,17.8 35.23,22.86 34.27,23.82 R2.2 | v19.91,16.94 20.42,16.43 | 20.42,16.43 v20.98,15.88 | v5.54,18.44 7.01,16.97 7.01,16.74 v7.92,15.82 | v20.93,20.42 20.47,19.96 20.47,16.48 20.42,16.43 | v64.31,15.77 64.77,16.23 v64.77,16.84 | v67.72,23.95 67.33,23.57 67.33,19.25 v67.44,19.15 | v56.84,16.94 v56.08,16.18 | v40.01,16.97 v39.19,16.15
DR3  (via drill 0.3)
  Top 0.152: v66.9,15.77 67.26,15.42 69.77,15.42 L3_4.A 69.85,15.44 71.68,15.44 73.74,17.5 L4_3.C 73.74,17.4 75.54,15.6 77.8,15.6 L3_5.A 77.72,15.42 78.66,16.36 80.52,16.36 81.1,16.94 | 81.1,16.94 L5_3.C | 81.1,16.94 81.15,16.89 84.15,16.89 L3_6.A 85.7,15.42 87.48,15.42 89.56,17.5 L6_3.C 89.66,17.5 91.44,17.5 | 91.44,17.5 93.52,15.42 L3_7.A 93.6,15.44 94.26,16.1 96.09,16.1 97.48,17.5 L7_3.C | v91.95,18.97 93.14,18.97 93.52,19.36 L3_2.A | v91.49,17.55 91.44,17.5 | v91.16,20.42 90.63,20.95 90.09,20.95 L2_3.C | 5.61,14.4 1.65,14.4 1.65,12.29 2.49,11.46 L3_8.A | 5.61,14.4 6.45,13.56 L8_3.C 6.5,13.49 7.26,12.72 9.14,12.72 L3_9.A 10.49,11.46 12.93,11.46 v13.23,11.76 | 9.35,18.01 7.59,16.26 5.77,16.26 5.61,16.1 5.61,14.4 | 9.35,18.01 9.68,18.34 10.92,18.34 11.23,18.64 13.64,18.64 14.35,19.36 L3_1.A | 9.35,18.01 7.14,20.22 4.85,20.22 4.85,21.39 5.77,22.3 9.6,22.3 10.41,21.49 L1_3.C | v36.6,13.18 37.74,13.18 38.1,13.54 L12_3.C | v35.23,11.81 34.87,11.46 34.24,11.46 L3_12.A 32.31,11.46 30.23,13.54 L11_3.C 30.15,13.51 29.29,12.65 24.92,12.65 24.05,11.79 | 24.05,11.79 22.3,13.54 L10_3.C 22.23,13.51 21.89,13.51 v21.23,12.85 | 24.05,11.79 24.26,11.58 26.11,11.58 26.24,11.46 L3_11.A | v20.5,12.06 18.97,12.06 18.39,11.48 L3_10.A 18.31,11.46 16.23,13.54 14.38,13.54 L9_3.C 14.3,13.54 14.02,13.54 v13.31,12.83 | v52.88,24.13 51.94,23.19 48.79,23.19 48.64,23.04 v37.16,23.04
  Bottom 0.152: v66.9,15.77 66.9,22.94 66.02,23.82 R3.2 65.94,23.9 65.18,24.66 52.88,24.66 v52.88,24.13 | v91.49,17.55 91.49,18.52 v91.95,18.97 91.9,19.02 91.9,19.68 v91.16,20.42 | v35.23,11.81 v36.6,13.18 36.93,13.51 36.93,22.81 v37.16,23.04 | v20.5,12.06 21.23,12.8 v21.23,12.85 | v13.23,11.76 13.31,11.84 v13.31,12.83
DR4  (via drill 0.3)
  Top 0.152: 79.83,13.28 79.58,13.54 77.72,13.54 L9_4.C 77.65,13.59 76.91,13.59 75.51,14.99 74.17,14.99 73.76,15.39 L4_3.A 73.69,15.39 73.28,14.99 v72.67,14.99 | 79.83,13.28 L4_10.A | 87.76,13.26 87.48,13.54 85.65,13.54 L10_4.C 85.55,13.56 85.5,13.56 84.66,14.4 80.95,14.4 79.83,13.28 | 87.76,13.26 89.56,11.46 L4_11.A | 96.11,12.39 94.69,12.39 93.55,13.54 L11_4.C 93.47,13.56 93.42,13.56 92.58,14.4 88.9,14.4 87.76,13.26 | 96.11,12.39 96.55,12.39 97.48,11.46 L4_12.A | v96.11,20.09 97.48,21.46 L2_4.C | v96.11,12.45 96.11,12.39 | 1.65,15.39 2.49,15.39 L4_2.A | 1.65,15.39 1.35,15.39 1.35,10.74 2.49,9.6 L12_4.C | 1.65,15.39 1.65,22.15 2.11,22.61 14.78,22.61 15.57,21.82 17.93,21.82 18.26,21.49 L1_4.C 19.91,19.89 21.77,19.89 22.28,19.38 L4_1.A 22.35,19.33 25.38,16.31 30.91,16.31 v31.27,15.95 | v51.21,11.81 50.37,11.81 50.01,11.46 L4_6.A | 60.96,12.06 61.19,12.29 63.58,12.29 64.41,11.46 65.81,11.46 L4_8.A 65.91,11.46 66.32,11.86 v67.44,11.86 | 60.96,12.06 60.58,11.68 58.17,11.68 57.94,11.46 L4_7.A | v60.81,13.28 61.62,13.28 61.87,13.54 L7_4.C | 60.96,12.06 v60.81,12.22 | v68.86,18.44 69.77,17.53 L3_4.C | v68.73,13.92 69.42,13.92 69.77,13.56 L8_4.C | v71.04,11.76 73.43,11.76 73.74,11.46 L4_9.A | v56.84,13.59 54.03,13.59 L6_4.C 53.95,13.54 52.93,13.54 v52.78,13.39 52.45,13.72 51.28,13.72 51.28,13.28 50.7,12.7 46.91,12.7 46.1,13.51 L5_4.C 46.02,13.54 44.17,13.54 L4_5.A 42.01,11.48 41.15,12.34 33.83,12.34 v33.1,13.08
  Bottom 0.152: v96.11,12.45 v96.11,20.09 | v52.78,13.39 v51.21,11.81 | v60.81,12.22 v60.81,13.28 60.76,13.34 60.76,15.47 58.73,15.47 v56.84,13.59 | R4.2 69.75,23.82 68.96,23.04 68.96,20.19 69.14,20.02 69.14,18.72 v68.86,18.44 68.81,18.39 68.81,13.99 v68.73,13.92 68.86,13.95 69.19,13.61 | 69.19,13.61 70.43,12.37 | 70.43,12.37 v71.04,11.76 | 69.19,13.61 v67.44,11.86 | v31.27,15.95 33.1,14.12 v33.1,13.08 | v72.67,14.99 72.03,14.35 72.03,13.97 70.43,12.37
DR5  (via drill 0.3)
  Top 0.152: 27.76,19.96 27.84,19.89 29.69,19.89 L5_1.A | 27.76,19.96 26.26,21.46 L1_5.C | v28.98,7.57 30.12,7.57 L5_9.A | v27.33,9.37 27.13,9.58 26.26,9.58 L8_5.C | v31.7,9.58 34.16,9.58 L9_5.C | v27.71,19.89 27.71,19.91 27.76,19.96 | L5_6.A 6.48,7.47 7.16,6.78 8.51,6.78 8.64,6.66 11.12,6.66 11.96,7.49 14.35,7.49 L5_7.A 14.45,7.52 14.96,8.03 16.54,8.03 17.2,8.69 17.2,9.55 17.22,9.6 | v7.54,16.97 7.01,16.97 6.48,17.5 L2_5.C | v9.09,15.42 L5_2.A | 17.22,9.6 16.38,10.44 11.28,10.44 10.44,9.6 L6_5.C 10.52,9.78 v9.12,11.18 | 17.22,9.6 18.26,9.6 L7_5.C 18.34,9.58 20.42,7.49 22.28,7.49 L5_8.A 22.35,7.52 v23.88,9.04 | v76.2,17.98 76.66,17.53 77.7,17.53 L3_5.C | v76.2,15.06 76.68,14.58 78.41,14.58 78.54,14.71 80.97,14.71 81.66,15.39 L5_3.A | 43.71,6.66 44.02,6.66 44.83,7.47 46.02,7.47 L5_11.A | 43.71,6.66 38.94,6.66 38.12,7.47 L5_10.A 38.05,7.47 35.61,7.47 v35.23,7.09 | 43.61,9.4 43.71,9.3 43.71,6.66 | 43.61,9.4 43.41,9.6 42.09,9.6 L10_5.C 42.01,9.6 41.45,9.6 v41.02,10.03 | v41.02,12.88 41.4,12.88 42.06,13.54 L4_5.C | v56.69,7.7 54.18,7.7 53.98,7.49 L5_12.A | v44.07,9.86 43.61,9.4 | v44.3,10.92 44.81,11.43 45.97,11.43 L5_4.A 46.05,11.43 46.28,11.2 47.24,11.2 48.13,10.31 49.28,10.31 49.99,9.6 L11_5.C 50.06,9.63 50.55,10.11 52.93,10.11 53.26,10.44 54.81,10.44 55.91,9.35 56.67,9.35 v56.72,9.3 57,9.58 57.91,9.58 L12_5.C 57.91,9.5 59.26,9.5 60.25,10.49 67.28,10.49 69.09,12.29 74.5,12.29 v74.68,12.47
  Bottom 0.152: 28.52,8.03 27.33,9.22 v27.33,9.37 27.38,9.42 27.38,11.46 | 28.52,8.03 v28.98,7.57 | 30.73,9.58 30,9.58 30,9.5 28.52,8.03 | 30.73,9.58 v31.7,9.58 | v27.71,19.89 27.38,19.56 27.38,11.46 | v7.54,16.97 v9.09,15.42 9.12,15.37 v9.12,11.18 | 27.38,11.46 23.88,11.46 v23.88,9.04 | R5.2 73.76,23.82 74.91,22.68 74.91,19.28 v76.2,17.98 v76.2,15.06 76.15,15.01 74.88,15.01 74.88,14.81 74.68,14.61 v74.68,12.47 | v41.02,10.03 v41.02,12.88 | v56.69,7.7 56.72,7.72 v56.72,9.3 | v44.07,9.86 44.3,10.08 v44.3,10.92 | 30.73,9.58 30.73,11.33 31.04,11.63 34.7,11.63 34.7,7.62 v35.23,7.09
DR6  (via drill 0.3)
  Top 0.152: 17.27,15.42 18.31,15.42 L6_2.A | 17.27,15.42 16.46,15.42 L2_6.C | 9.8,8.1 8.33,9.58 6.48,9.58 L5_6.C | 9.8,8.1 L6_5.A 10.46,7.54 11.25,8.33 16.08,8.33 v16.66,8.91 | 7.29,5.61 7.29,2.82 7.16,2.69 3.35,2.69 2.52,3.53 L6_12.A | 7.29,5.61 6.48,5.61 L12_6.C | 9.8,8.1 8.89,7.19 v8.87,7.19 | 7.29,5.61 v7.52,5.84 | v17.27,15.11 17.27,15.42 | v41.07,14.55 43,14.55 | 43,14.55 49,14.55 49.99,13.56 L4_6.C | v40.95,18.03 39.62,19.36 38.12,19.36 L6_1.A 38.05,19.38 36.45,19.38 v36.09,19.74 | v35.76,21.11 34.54,21.11 34.19,21.46 L1_6.C | L11_6.C 97.51,9.6 98.35,10.44 98.35,12.7 96.62,12.7 94.74,14.58 92.84,14.58 92.02,15.39 89.59,15.39 L6_3.A 89.51,15.39 89.31,15.39 88.49,14.58 84.91,14.58 v83.54,15.95 83.24,16.26 80.97,16.26 v80.54,15.82 | v84.15,17.42 85.55,17.42 L3_6.C | v55.52,11.25 54.15,11.25 53.98,11.43 L6_4.A | 90.42,9.58 89.59,9.58 L10_6.C | 90.42,9.58 91.44,9.58 93.52,7.49 L6_11.A | 90.42,9.58 90.42,6.66 86.51,6.66 85.7,7.47 L6_10.A 83.77,7.49 81.69,9.58 L9_6.C 81.61,9.55 80.75,8.69 79.32,8.69 78.16,7.52 77.78,7.52 L6_9.A 77.7,7.49 75.01,10.19 74.88,10.19 v74.83,10.24 74.19,9.6 73.76,9.6 L8_6.C 73.69,9.55 72.21,8.08 70.41,8.08 69.85,7.52 L6_8.A 69.77,7.49 69.42,7.85 67.03,7.85 65.86,9.02 L7_6.C 65.81,9.58 65.81,9.07 64.67,7.92 62.33,7.92 61.9,7.49 L6_7.A 61.8,7.52 60.88,7.52 60.07,8.33 56.24,8.33 v56.13,8.23 56.13,8.33 44.5,8.33 v44.3,8.53 | v43,14.48 43,14.55 | v16.69,22.91 16.92,23.14 v35.71,23.14
  Bottom 0.152: v7.52,5.84 v8.87,7.19 | v16.66,8.91 17.3,9.55 17.3,15.09 v17.27,15.11 16.69,15.7 v16.69,22.91 | v41.07,14.55 40.95,14.68 v40.95,18.03 | v36.09,19.74 36.09,20.78 v35.76,21.11 35.71,21.16 v35.71,23.14 | v84.15,17.42 83.54,16.82 v83.54,15.95 | v55.52,11.25 56.13,10.64 v56.13,8.23 | 78.56,19.63 78.56,19 77.34,17.78 77.34,12.75 v74.83,10.24 | 78.56,19.63 78.56,23.04 77.78,23.82 R6.2 | v80.54,15.82 79.63,16.74 79.63,19.33 79.32,19.63 78.56,19.63 | v43,14.48 42.65,14.12 42.65,8.84 42.95,8.53 v44.3,8.53
DR7  (via drill 0.3)
  Top 0.152: v43.16,21.11 42.44,21.11 L1_7.C | v43.54,20.04 43.61,19.96 45.44,19.96 46.02,19.38 L7_1.A | L10_7.C 30.23,5.64 30.76,6.17 33.17,6.17 33.48,6.48 37.26,6.48 38.1,5.64 L11_7.C 38.2,5.64 38.84,5.64 v39.19,5.28 | v40.21,4.27 41.35,4.27 42.06,3.56 L7_12.A | v43.89,5.33 45.74,5.33 46.02,5.61 L12_7.C | v82.96,23.42 83.24,23.14 v89.31,23.14 | v92.48,17.91 92.86,17.53 93.52,17.53 L3_7.C | v94.82,15.57 97.33,15.57 97.48,15.42 L7_3.A | v60.81,9.96 61.52,9.96 61.87,9.6 L6_7.C 61.95,9.6 v63.48,9.6 | v60.81,11.02 61.21,11.43 61.87,11.43 L7_4.A | v59.21,13.28 58.19,13.28 57.94,13.54 L4_7.C | v64.77,7.32 65.66,7.32 65.81,7.47 L7_6.A | L7_8.A 10.44,3.53 11.28,2.69 17.48,2.69 18.31,3.53 L7_9.A 18.39,3.56 21.46,3.56 | L7_2.A 26.24,15.42 25.65,16 23.8,16 L2_7.C 22.23,17.48 21.16,16.41 17.53,16.41 v17.5,16.43 | 21.46,4.8 17.27,4.8 | 17.27,4.8 15.19,4.8 14.38,5.61 L8_7.C | 21.46,4.8 22.28,5.61 L9_7.C | v17.27,7.01 17.86,7.01 18.31,7.47 L7_5.A | 17.27,4.8 v17.27,5.69 | v15.9,8.91 15.04,8.91 14.38,9.58 L5_7.C | 21.46,4.8 21.46,3.56 | 21.46,3.56 21.46,2.82 21.59,2.69 25.4,2.69 26.24,3.53 L7_10.A 26.31,3.5 27.13,2.69 33.33,2.69 L7_11.A 34.24,3.5 35.36,2.39 40.26,2.39 | 40.26,2.39 41.25,2.39 41.94,1.7 44.6,1.7 45.36,0.94 66.57,0.94 v66.8,1.17 66.83,1.09 v84.35,1.09 | v40.26,2.44 40.26,2.39
  Bottom 0.152: v43.54,20.04 43.54,20.73 v43.16,21.11 42.85,21.41 42.85,21.87 42.7,22.02 40.41,22.02 40.41,17.32 40.54,17.2 40.54,13.46 39.73,12.65 39.73,4.85 39.67,4.8 | v39.19,5.28 39.67,4.8 | 39.67,4.8 v40.21,4.27 40.26,4.22 v40.26,2.44 40.26,1.17 41.4,1.17 42.62,2.39 42.62,4.06 v43.89,5.33 | v82.96,23.42 82.96,23.82 81.76,23.82 R7.2 | v89.31,23.14 92.48,19.96 v92.48,17.91 v94.82,15.57 91.24,11.99 91.24,7.98 v84.35,1.09 | v60.81,9.96 v60.81,11.02 60.76,11.07 60.76,11.4 60.27,11.89 60.27,12.22 v59.21,13.28 | v63.48,9.6 63.48,8.61 v64.77,7.32 66.75,5.33 66.75,1.22 v66.8,1.17 | v17.27,5.69 v17.27,7.01 17.22,7.06 17.22,7.59 16.66,8.15 | 16.66,8.15 v15.9,8.91 | v17.5,16.43 17.91,16.03 17.91,9.4 16.66,8.15
DR8  (via drill 0.3)
  Top 0.152: L8_2.A 34.19,15.42 35.76,15.42 35.76,18.03 35.46,18.34 31.04,18.34 L2_8.C 30.15,17.48 29.82,17.14 v29.13,17.14 | L3_8.C 2.52,13.54 4.37,13.54 L8_3.A 6.43,11.38 5.61,10.57 5.61,6.48 8.36,6.48 9.17,5.66 10.36,5.66 L7_8.C 10.44,5.61 12.29,5.61 14.35,3.56 L8_7.A 14.43,3.58 15.21,4.37 20.4,4.37 v20.5,4.27 | v20.83,8.03 22.3,9.5 L5_8.C 22.3,9.58 24.16,9.58 26.24,7.49 L8_5.A 26.31,7.52 26.59,7.52 v28.19,9.12 | 52.58,3.38 50.16,3.38 50.01,3.53 L8_9.A | 52.58,3.38 53.26,2.69 54.69,2.69 55.52,3.53 L8_10.A 57.96,3.48 58.06,3.38 59.18,3.38 59.87,2.69 64.97,2.69 65.81,3.53 L8_11.A 65.89,3.58 66.22,3.91 v68.35,3.91 | v52.88,5.33 53.67,5.33 53.95,5.61 L9_8.C | v52.63,3.43 52.58,3.38 | 75.36,3.76 75.84,3.76 77.7,5.61 L12_8.C | 75.36,3.76 73.97,3.76 73.76,3.56 L8_12.A | L8_4.A 69.8,11.43 69.8,9.6 L6_8.C 69.88,9.58 70.54,8.91 v70.87,8.91 | L10_8.C 61.9,5.61 62.71,4.8 68.96,4.8 69.77,5.61 L11_8.C 69.85,5.66 71.93,5.66 72.06,5.79 | 72.06,5.79 73.03,6.76 | 73.03,6.76 73.74,7.47 L8_6.A | 73.03,6.76 v72.67,7.11 | 75.36,3.76 75.36,4.83 74.47,4.83 74.45,4.8 73.05,4.8 72.06,5.79 | L8_1.A 52.09,19.38 50.01,21.46 L1_8.C 50.55,21.03 51.1,21.59 v51.13,21.59 | v84.73,24.43 84.68,24.49 66.27,24.49 v64.97,23.19 63.5,24.66 52.38,24.66 v51.44,23.72 50.75,24.41 v33.2,24.41 | v64.77,13.72 64.92,13.56 65.81,13.56 L4_8.C 65.91,13.54 66.29,13.54 v66.9,12.93
  Bottom 0.152: v20.83,8.03 20.5,7.7 v20.5,4.27 | 29.52,16.76 30,16.28 30,13.03 27.96,11 27.96,9.35 v28.19,9.12 | 29.52,16.76 v29.13,17.14 | v52.88,5.33 52.63,5.08 v52.63,3.43 | v72.67,7.11 72.11,7.67 | 72.11,7.67 v70.87,8.91 70.81,8.94 68,8.94 68,10.54 66.9,11.63 v66.9,12.93 | 72.11,7.67 v68.35,3.91 | v84.73,24.43 84.73,24.49 85.09,24.49 85.72,23.85 R8.2 | v64.97,23.19 63.48,21.69 63.48,17.6 63.25,17.37 63.25,15.24 v64.77,13.72 | v51.13,21.59 50.98,21.74 50.98,23.27 v51.44,23.72 | 29.52,16.76 33.2,20.45 v33.2,24.41
DR9  (via drill 0.3)
  Top 0.152: 86.46,2.69 88.72,2.69 89.56,3.53 L9_11.A 89.64,3.58 90.09,3.58 v90.65,4.14 | 86.46,2.69 82.53,2.69 81.69,3.53 L9_10.A | 86.46,2.69 86.46,4.8 85.65,5.61 L10_9.C 85.57,5.66 84.71,6.53 82.63,6.53 81.69,7.47 L9_6.A 81.61,7.54 81,8.15 v79.55,8.15 | v91.42,4.9 92.81,4.9 93.52,5.61 L11_9.C | v94.61,3.56 97.48,3.56 L9_12.A | v62.94,19.79 62.31,19.79 61.9,19.38 L9_1.A | v62.94,20.85 62.71,20.62 58.78,20.62 57.94,21.46 L1_9.C | v64.24,12.39 68.76,12.39 69.06,12.7 72.87,12.7 73.69,13.51 L4_9.C 73.76,13.54 74.3,13.01 76.12,13.01 77.65,11.48 L9_4.A 77.72,11.43 77.72,9.6 L6_9.C 77.8,9.6 78.11,9.6 v78.79,8.91 | 14.94,12.24 14.38,11.68 L9_3.A | 14.94,12.24 v15.19,12.5 | 11.68,12.29 10.44,13.54 L3_9.C | 11.68,12.29 14.88,12.29 14.94,12.24 | L9_2.A 42.06,15.42 41.05,16.43 39.67,16.43 38.61,17.5 L2_9.C 38.66,17.55 39.06,17.55 v39.06,18.41 | 23.14,4.8 23.14,6.48 19.18,6.48 L7_9.C 18.26,5.66 17.45,6.48 12.68,6.48 v12.19,6.96 | 23.14,4.8 23.14,4.39 22.3,3.56 L9_7.A | 31.27,6.78 31.04,6.78 30.73,6.48 29.36,6.48 | 31.27,6.78 33.48,6.78 34.16,7.47 L9_5.A 34.24,7.52 34.9,7.52 v35.23,7.85 | 29.36,6.48 28.63,6.48 26.95,4.8 23.14,4.8 | v31.27,8.91 30.89,8.91 30.23,9.58 L5_9.C | v31.27,6.83 31.27,6.78 | 29.36,6.48 29.36,4.95 29.57,4.75 39.42,4.75 39.47,4.8 49.17,4.8 49.99,5.61 L8_9.C 50.06,5.61 51.16,5.61 51.97,4.8 54.91,4.8 v55.02,4.9 55.02,4.8 59.26,4.8 60.94,6.48 62.41,6.48 v62.94,7.01 | v55.02,3.83 54.25,3.83 53.98,3.56 L9_8.A | v11.66,11.99 11.66,12.24 11.68,12.29
  Bottom 0.152: v90.65,4.14 v91.42,4.9 91.47,4.85 93.32,4.85 v94.61,3.56 | v62.94,20.85 v62.94,19.79 62.94,13.69 v64.24,12.39 62.94,11.1 v62.94,7.01 | v78.79,8.91 v79.55,8.15 | R9.2 15.19,22.91 v15.19,12.5 | v39.06,18.41 39.06,22.45 38.25,23.27 L12_9.C 38.46,22.96 37.34,21.84 37.34,11.1 35.23,8.99 v35.23,7.85 | v31.27,6.83 v31.27,8.91 | v55.02,4.9 v55.02,3.83 | v11.66,11.99 11.66,7.49 v12.19,6.96
DR10  (via drill 0.3)
  Top 0.152: 83.13,5.61 81.69,5.61 L9_10.C | 83.13,5.61 83.57,5.61 85.62,3.56 L10_9.A | v68.61,19.79 69.37,19.79 69.77,19.38 L10_1.A 69.85,19.33 70.66,18.52 79.27,18.52 80.97,20.22 82.68,20.22 v83.52,19.38 | v68.28,21.16 67.97,21.46 L1_10.C 65.76,21.49 65.25,22 v62.94,22 | v82.78,12.75 82.47,12.75 81.69,13.54 L4_10.C | v83.54,11.99 84.1,11.43 85.55,11.43 L10_4.A 85.62,11.43 85.62,9.6 L6_10.C 85.7,9.58 87.48,9.58 89.56,7.49 L10_6.A | v83.13,5.99 83.13,5.61 | v58.93,6.48 58.78,6.48 57.94,5.64 L8_10.C | v59.31,3.91 59.66,3.56 61.87,3.56 L10_8.A | v43.87,18.87 44.68,18.87 46.02,17.53 L2_10.C 46.1,17.55 47.24,17.55 v48.51,18.82 | v47.12,15.62 48.92,15.62 | 48.92,15.62 49.78,15.62 49.99,15.42 L10_2.A | v48.92,21.92 49.3,22.3 50.7,22.3 50.88,22.12 51.89,22.12 v52.88,23.11 52.93,23.06 v62.94,23.06 | v52.38,10.64 52.35,10.62 49.3,10.62 48.92,11 v48.92,11.81 | v48.92,15.57 48.92,15.62 | L3_10.C 18.34,13.56 18.92,13.56 v19.41,14.05 19.38,13.92 19.41,13.92 21.01,12.32 21.41,12.32 22.28,11.46 L10_3.A 22.35,11.4 22.84,10.92 v25.02,10.92 | 27.18,6.55 29.01,8.38 37.06,8.38 | 27.18,6.55 26.26,5.64 L7_10.C | 41.02,8.38 41.17,8.38 42.06,7.49 L10_5.A | 41.02,8.38 37.06,8.38 | v28.32,5.41 28.35,5.41 30.2,3.56 L10_7.A | v27.23,6.5 27.18,6.55 | v37.06,9.25 37.77,9.25 38.1,9.58 L5_10.C | 37.06,8.38 v37.06,8.18 | 41.02,8.38 v41.02,8.18
  Bottom 0.152: v68.61,19.79 68.28,20.12 v68.28,21.16 | v83.52,19.38 82.83,18.69 82.83,12.8 v82.78,12.75 v83.54,11.99 83.49,11.94 83.49,6.35 v83.13,5.99 | v58.93,6.48 58.55,6.1 58.55,4.75 | 58.55,4.75 58.55,4.67 v59.31,3.91 | 43.54,19.2 42.01,20.73 42.01,21.16 L10_11.A | 43.54,19.2 v43.87,18.87 45.03,17.7 | 43.54,19.2 44.07,19.74 44.07,21.31 46.02,23.27 L11_10.C | 45.03,17.7 v47.12,15.62 | v48.51,18.82 48.51,19.63 50.04,21.16 L10_12.A 49.81,21.03 v48.92,21.92 | v52.88,23.11 52.88,23.27 54.05,23.27 L12_10.C | 58.55,4.75 55.55,4.75 55.55,7.19 53.42,9.32 53.42,9.6 v52.38,10.64 | v48.92,15.57 v48.92,11.81 | v19.41,14.05 19.38,14.07 19.38,22.71 18.26,23.82 R10.2 | v28.32,5.41 v27.23,6.5 27.18,6.55 27.18,8.76 v25.02,10.92 | v37.06,8.18 v37.06,9.25 | 45.03,17.7 41.55,14.22 41.55,8.71 v41.02,8.18 | v62.94,23.06 v62.94,22
DR11  (via drill 0.3)
  Top 0.152: L11_1.A 77.7,19.38 76.68,19.38 75.67,20.4 74.83,20.4 73.76,21.46 L1_11.C 73.69,21.51 72.9,22.3 63.4,22.3 63.17,22.53 61.06,22.53 v60.91,22.38 60.78,22.25 v58.98,22.25 | 55.52,17.5 56.62,16.41 56.92,16.41 L11_2.A | 55.52,17.5 53.98,17.5 L2_11.C 53.9,17.55 51.71,17.55 50.93,18.34 49.15,18.34 49.15,18.97 v48.11,20.02 | 55.52,17.5 v56.84,18.82 | v47.09,23.88 v43.08,23.88 42.85,24.11 33.66,24.11 33.22,23.67 v25.2,23.67 | L4_11.C 89.59,13.54 91.64,11.48 93.47,11.48 L11_4.A 93.55,11.43 93.55,9.6 L6_11.C 93.62,9.6 95.38,9.6 97.48,7.49 L11_6.A 97.43,7.44 93.6,3.61 93.57,3.61 L11_9.A 93.52,3.56 92,3.56 91.57,3.99 | v67.82,5.33 66.12,5.33 65.84,5.61 L8_11.C | 91.57,3.99 90.88,4.67 90.53,4.67 89.59,5.61 L9_11.C | 91.57,3.99 89.92,2.34 71.02,2.34 69.85,3.5 L11_8.A 69.77,3.53 69.62,3.38 67.84,3.38 v67.82,3.35 67.82,2.01 59.97,2.01 59.51,1.55 53.42,1.55 52.65,2.31 50.85,2.31 50.47,2.69 49.3,2.69 49.02,2.97 47.12,2.97 | v47.12,7.11 49.63,7.11 49.99,7.47 L11_5.A | v47.12,9.37 46.91,9.58 46.05,9.58 L5_11.C | v35.23,5.28 34.52,5.28 34.19,5.61 L7_11.C | v36.3,4.22 36.96,3.56 38.1,3.56 L11_7.A 38.2,3.5 40.21,3.5 41.02,2.69 42.77,2.69 42.85,2.77 43.38,2.77 43.46,2.69 47.12,2.69 47.12,2.97 | v25.17,13.89 25.5,13.56 26.24,13.56 L3_11.C | v25.17,12.12 25.35,12.29 29.36,12.29 L11_3.A 30.28,11.43 30.94,11.43 v31.27,11.1 | 47.12,2.97 v47.12,3.68
  Bottom 0.152: v48.11,20.02 47.19,20.02 46.05,21.16 L11_10.A 46.08,21.23 46.86,22.02 46.86,23.65 v47.09,23.88 | v56.84,18.82 56.84,20.17 57.84,21.16 L11_12.A 57.91,21.18 v58.98,22.25 | v43.08,23.88 43.08,23.29 42.01,23.29 L10_11.C | v60.91,22.38 60.96,22.38 61.85,23.27 L12_11.C | v67.82,3.35 v67.82,5.33 | v47.12,9.37 46.69,8.94 46.69,7.11 v47.12,7.11 v47.12,3.68 | v36.3,4.22 v35.23,5.28 32.36,8.15 32.36,10.01 v31.27,11.1 | 23.8,22.28 23.88,22.2 23.88,15.19 v25.17,13.89 v25.17,12.12 | 23.8,22.28 22.25,23.82 R11.2 | 23.8,22.28 v25.2,23.67
DR12  (via drill 0.3)
  Top 0.152: 98.35,13.54 97.51,13.54 L4_12.C | 98.35,13.54 98.65,13.54 98.65,6.78 L9_12.C | 98.35,13.54 98.35,18.19 98.09,18.44 88.98,18.44 88.77,18.64 86.41,18.64 85.7,19.36 L12_1.A 85.09,19.38 83.95,20.52 82.63,20.52 81.69,21.46 L1_12.C 81.61,21.44 79.27,19.1 v79.1,19.1 | 74.6,6.48 73.76,5.64 L8_12.C | 74.6,6.48 78.41,6.48 78.56,6.33 78.56,3.56 77.72,3.56 L12_8.A | v44.3,4.27 45.31,4.27 46.02,3.56 L12_7.A | v52.88,9.37 53.75,9.37 53.95,9.58 L5_12.C | v60.68,6.99 60.2,7.47 57.99,7.47 L12_5.A 57.91,7.47 57.61,7.16 55.22,7.16 v55.02,6.96 54.56,6.5 44.3,6.5 v43.89,6.1 43.43,5.64 L7_12.C 42.01,5.66 41.55,6.12 v39.19,6.12 | 74.6,8.33 74.6,6.48 | 74.6,8.33 72.9,8.33 71.04,6.48 63.22,6.48 v62.94,6.2 | v74.7,8.43 74.6,8.33 | v54.99,20.22 56.92,20.22 | 56.92,20.22 59.18,20.22 61.87,17.53 L2_12.C 61.95,17.5 63.42,17.5 v63.78,17.14 | v64.77,15.14 65.56,15.14 65.81,15.39 L12_2.A | 56.92,20.22 v56.92,22.33 | v39.19,11.81 38.48,11.81 L12_3.A | L12_6.A 6.45,3.56 4.37,5.64 2.59,5.64 L6_12.C 2.52,5.64 2.52,7.47 L12_4.A 2.59,7.47 4.88,9.75 v5.08,9.75 | v8.59,13.26 9.91,14.58 26.98,14.58 27.99,15.6 v27.91,15.77 29.29,14.4 33.2,14.4 34.04,13.56 34.16,13.56 L3_12.C 34.21,13.49 35.05,12.65 38.96,12.65 v39.19,12.88
  Bottom 0.152: v44.3,4.27 44.42,4.39 44.42,5.56 v43.89,6.1 | v52.88,9.37 55.02,7.24 v55.02,6.96 | v60.68,6.99 61.42,7.72 | 61.42,7.72 61.65,7.95 61.65,20.95 61.85,21.16 L12_11.A | 61.42,7.72 v62.94,6.2 | v79.1,19.1 77.65,17.65 77.65,11.38 v74.7,8.43 | 48.44,24.41 48.44,23.5 48.74,23.19 50.04,23.19 50.04,23.27 L10_12.C | 48.44,24.41 48.44,24.56 52.17,24.56 52.35,24.38 52.35,22.89 54.05,21.18 L12_10.A 54.1,21.11 v54.99,20.22 | v64.77,15.14 63.78,15.14 v63.78,17.14 | v56.92,22.33 56.92,22.35 57.84,23.27 L11_12.C | 38.66,12.34 38.25,12.75 38.25,17.27 | 38.66,12.34 v39.19,11.81 v39.19,6.12 | 38.25,17.27 38.25,21.16 L12_9.A | v27.91,15.77 28.25,16.1 28.25,20.42 26.59,20.42 25.45,21.57 25.45,23.04 26.24,23.82 R12.2 | v8.59,13.26 v5.08,9.75 | v39.19,12.88 38.66,12.34 | 48.44,24.41 43.61,24.41 43.61,23.34 42.6,22.33 39.73,22.33 39.73,17.58 39.42,17.27 38.25,17.27
GNDA  (via drill 0.3)
  Top 0.152: v70.87,15.98 70.54,16.31 61.24,16.31 v59.87,14.94 | v90.4,20.42 90.19,20.62 88.01,20.62 85.8,22.84 v72.72,22.84 | v46.18,1.47 v52.3,1.47
  Bottom 0.152: 56.79,11.86 56.57,12.09 55.17,12.09 | 56.79,11.86 57.63,11.02 C1.2 57.25,11.3 57.25,8.26 59.59,8.26 59.74,8.1 59.74,5.89 59.36,5.51 C2.2 59.38,5.44 59.84,4.98 59.84,3.68 57.63,1.47 v52.3,1.47 | 55.17,12.09 54.3,12.09 IC1.5 | 55.17,12.09 55.17,13.69 54.3,13.69 IC1.3 | 56.79,11.86 v59.87,14.94 | DOWNSW.B2 71.02,14.76 70.87,14.91 v70.87,15.98 70.92,16.03 70.92,21.03 v72.72,22.84 | v90.4,20.42 90.4,15.42 90.04,15.06 J1.P$7 | GND.TP 8.51,22.48 8.51,19.86 C3.2 8.59,19.86 10.46,19.86 | 10.46,19.86 12.5,19.86 C4.2 | 19.96,5.16 15.49,5.16 14.86,4.52 R13.1 14.78,4.47 14.78,3.71 12.55,3.71 11.35,4.9 11.35,10.29 10.46,11.18 10.46,19.86 | 19.96,5.16 19.96,13.69 21.01,14.73 UPSW.B2 | 44.83,2.82 44.83,12.88 45.7,12.88 IC1.21 | 44.83,2.82 42.44,0.43 19.96,0.43 19.96,5.16 | 44.83,2.82 v46.18,1.47
MISO  (via drill 0.3)
  Top 0.152: v47.88,9.35 48.46,8.76 60.5,8.76 60.6,8.87 61.06,8.87 61.16,8.76 63.4,8.76 v64.59,9.96
  Bottom 0.152: v47.88,9.35 47.47,8.94 47.47,8.48 47.22,8.23 IC1.16 | v64.59,9.96 66.37,11.73 66.37,13.95 67.97,15.54 67.97,20.6 67.64,20.93 67.64,23.11 69.11,24.59 84.2,24.59 84.2,24 85.32,22.89 88.8,22.89 88.8,11.2 90.02,9.98 J1.P$1
MOSI  (via drill 0.3)
  Top 0.152: v50.39,2.01 52.53,2.01 53.29,1.25 66.12,1.25 66.57,1.7 69.16,1.7 69.24,1.63 v72.21,1.63 | v75.67,16.23 76.1,16.66 79.27,16.66 80.95,18.34 82.8,18.34 83.08,18.06 84.63,18.06 84.91,18.34 86.33,18.34 v87.25,17.42
  Bottom 0.152: v50.39,2.01 50.39,1.91 48.56,1.91 48.26,2.21 48.26,7.95 IC1.15 | v72.21,1.63 74.14,3.56 74.14,14.71 v75.67,16.23 | v87.25,17.42 87.48,17.2 87.48,15.06 J1.P$4
N$1
  Bottom 0.152: C2.1 57.66,5.51 57.66,7.26 57.91,7.52 Q1.3 57.61,7.16 56.44,7.16 55.6,8 55.6,8.38 54.3,9.68 IC1.8
N$2  (via drill 0.3)
  Top 0.152: v48.79,2.44 48.59,2.23 v43.16,2.23
  Bottom 0.152: v48.79,2.44 IC1.14 | v43.16,2.23 41.66,0.74 21.36,0.74 21.36,9.91 21.03,10.24 UPSW.A2
N$3  (via drill 0.3)
  Top 0.152: v53.06,20.32 53.06,22.53 v56.06,22.53 | v60.83,8.33 60.96,8.46 v64.44,8.46 | v68.73,9.47 v67.72,8.46
  Bottom 0.152: v53.06,20.32 53.31,20.07 53.31,13.16 49.89,9.73 49.89,8.51 49.61,8.23 IC1.13 | v56.06,22.53 57,23.47 57,23.98 57.12,24.11 60.38,24.11 60.38,21.49 61.04,20.83 61.04,15.62 61.34,15.32 61.34,8.84 v60.83,8.33 | v67.72,8.46 v64.44,8.46 | v68.73,9.47 69.49,10.24 71.02,10.24 DOWNSW.A2
N$4  (via drill 0.3)
  Top 0.152: v55.52,10.49 55.58,10.44 58.62,10.44 v59.03,10.03
  Bottom 0.152: 59.33,10.03 59.33,11 C1.1 | 59.33,10.03 59.33,9.25 59.08,8.99 Q1.1 | v55.52,10.49 54.3,10.49 IC1.7 | 59.33,10.03 v59.03,10.03
N$5
  Bottom 0.152: R13.2 13.16,4.52 14.83,6.2 14.83,6.99 R14.1 14.83,7.06 14.83,9.4 IC2.1
RESET  (via drill 0.3)
  Top 0.152: v52.27,14.48 52.35,14.4 68.45,14.4 68.5,14.45 v75.29,14.45 | v76.63,21.92 77.01,22.3 v80.21,22.3
  Bottom 0.152: v52.27,14.48 50.67,16.08 50.67,16.54 50.42,16.79 IC1.29 | v75.29,14.45 76.73,14.45 76.73,21.82 v76.63,21.92 | v80.21,22.3 80.85,22.94 82.68,22.94 84.15,21.46 84.94,21.46 84.94,15.06 J1.P$5
SCK  (via drill 0.3)
  Top 0.152: v51.23,2.85 51.46,2.62 52.91,2.62 53.44,2.08 v59.28,2.08 | v75.39,2.87 75.56,2.69 79.3,2.69 81.41,4.8 v82.7,4.8
  Bottom 0.152: v51.23,2.85 51.23,1.47 48.56,1.47 46.38,3.66 46.38,9.02 45.72,9.68 IC1.17 | v59.28,2.08 61.04,0.33 73.3,0.33 73.3,0.79 v75.39,2.87 | v82.7,4.8 84.94,7.04 84.94,9.96 J1.P$3

### Text on the board
bNames: 0805 charlie array v1 | bryan duxbury 8/26/2013